# EAGLE schematic IM-EG2-Bottom-Board (EAGLE 7.5.0)
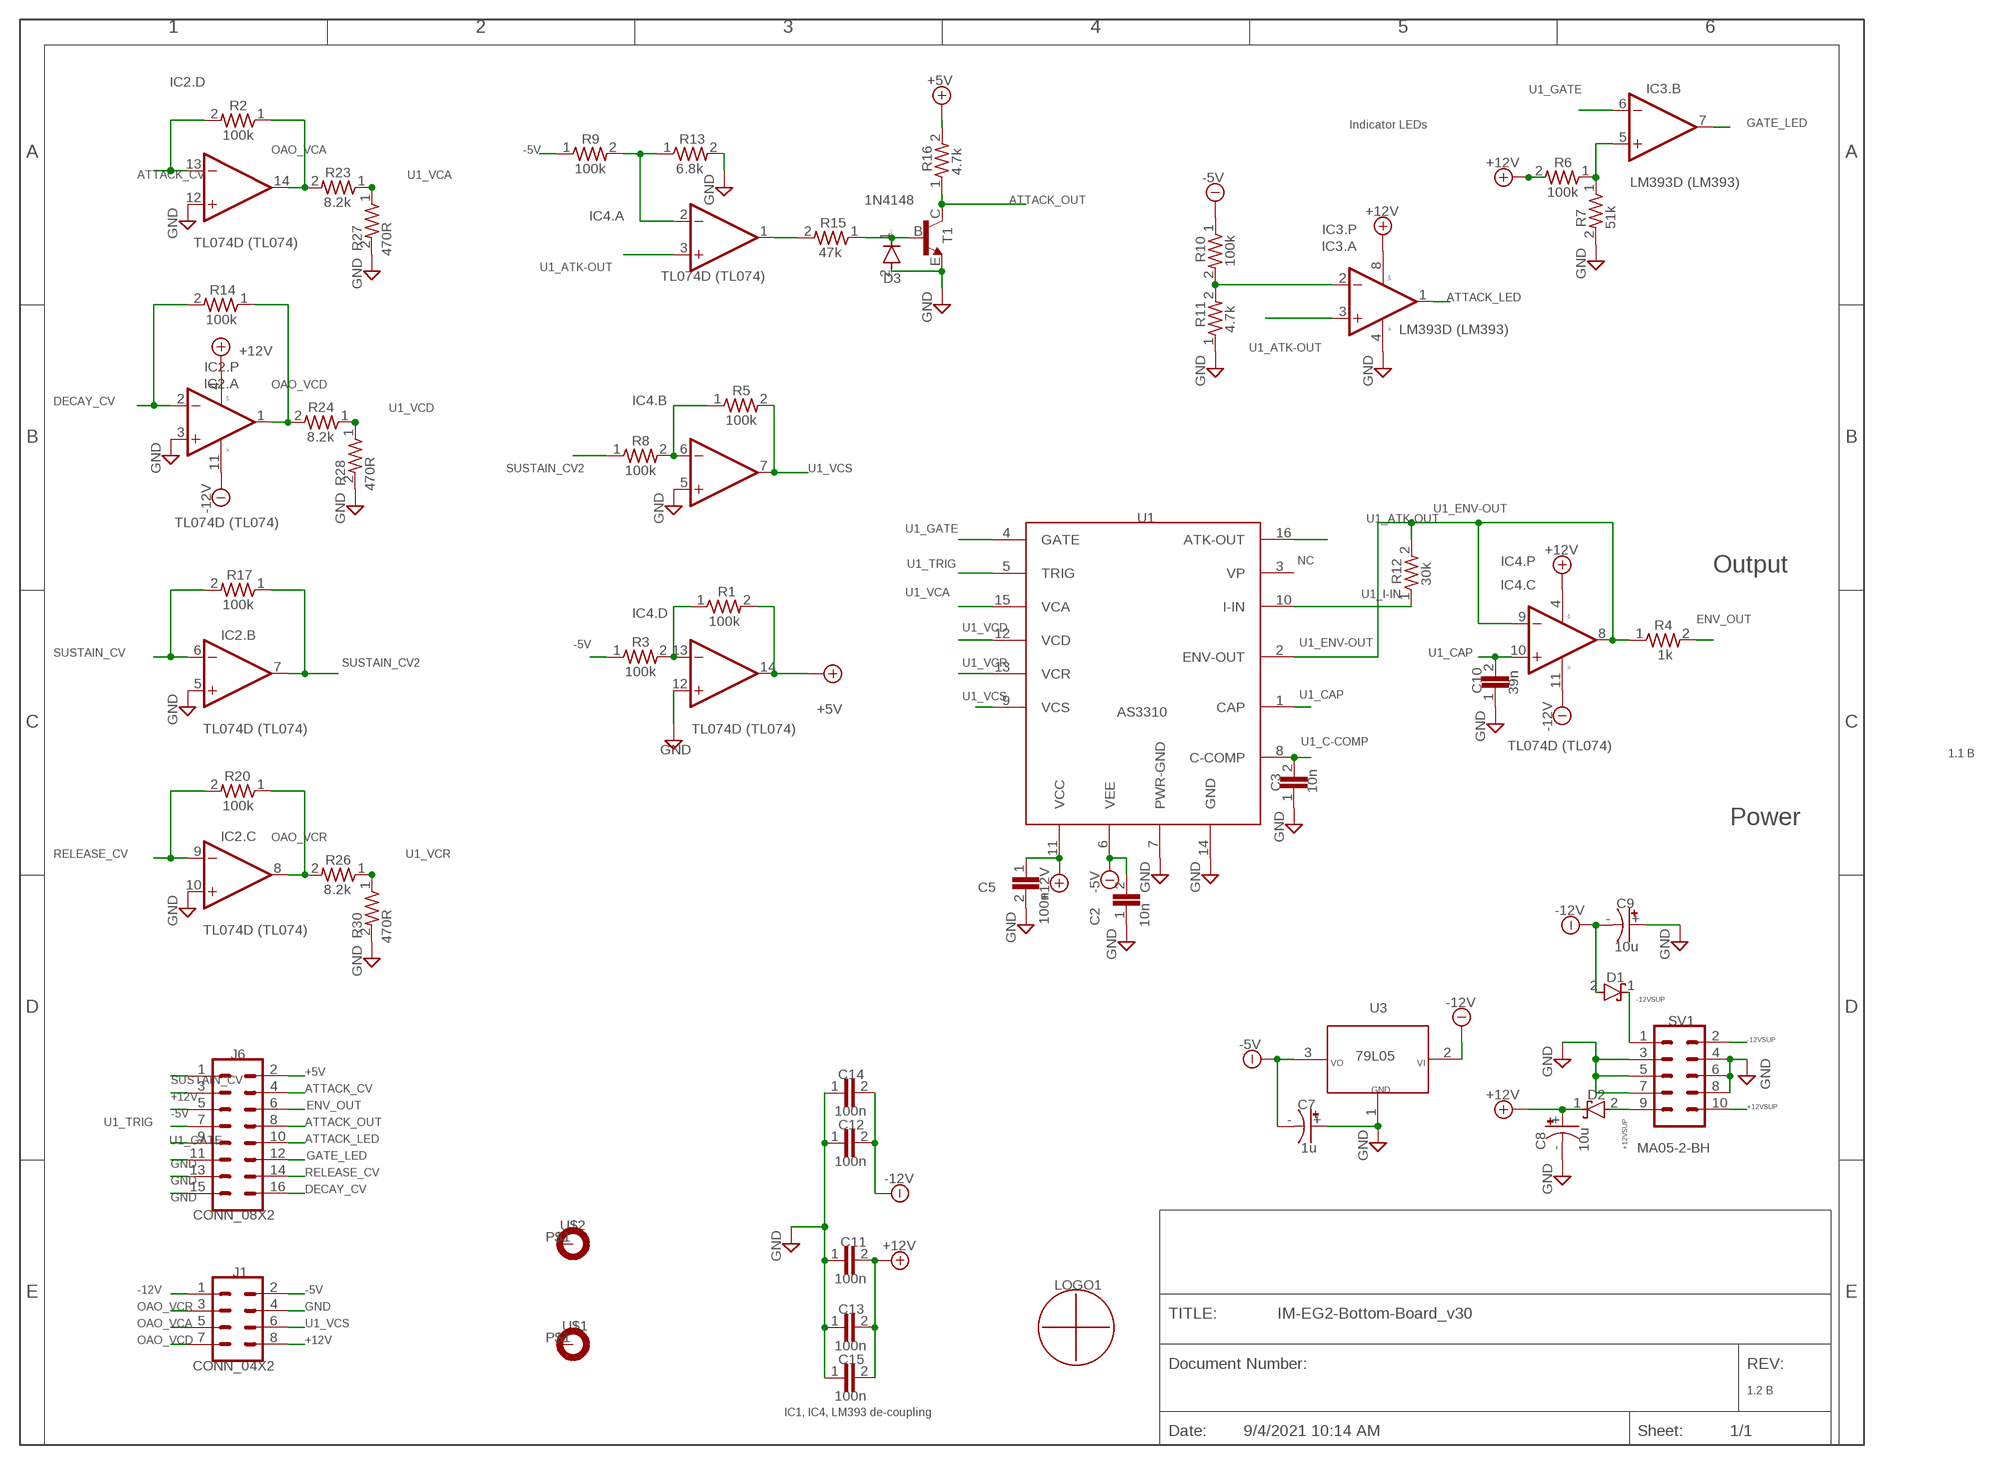
[diagram p0: schematic, sheet 1]

## Parts
C2  10n  C-EUC0805_(C-EU)  [C0805]
C3  10n  C-EUC0805_(C-EU)  [C0805]
C5  100n  C-EUC0805_(C-EU)  [C0805]
C7  1u  CPOL-USE2-5_(CPOL-US)  [E2-5]
C8  10u  CPOL-USE2-5_(CPOL-US)  [E2-5]
C9  10u  CPOL-USE2-5_(CPOL-US)  [E2-5]
C10  39n  C-EUC0805_(C-EU)  [C0805]
C11  100n  C-EUC0805_(C-EU)  [C0805]
C12  100n  C-EUC0805_(C-EU)  [C0805]
C13  100n  C-EUC0805_(C-EU)  [C0805]
C14  100n  C-EUC0805_(C-EU)  [C0805]
C15  100n  C-EUC0805_(C-EU)  [C0805]
D1  STPS1L60ZFSOD-123_(STPS1L60ZF)  [SOD3516X98N]
D2  STPS1L60ZFSOD-123_(STPS1L60ZF)  [SOD3516X98N]
D3  1N4148  1N4148SOD-123_(1N4148)  [SOD3715X135]
IC2  TL074D_(TL074)  [SO14]
IC3  LM393D_(LM393)  [SO08]
IC4  TL074D_(TL074)  [SO14]
J1  CONN_04X2  [2X4]
J6  CONN_08X2  [2X8]
LOGO1  IM-LOGO-4MM-1M  [IM-LOGO-4MM-1M]
R1  100k  R-US_R0805_(R-US_)  [R0805]
R2  100k  R-US_R0805_(R-US_)  [R0805]
R3  100k  R-US_R0805_(R-US_)  [R0805]
R4  1k  R-US_R0805_(R-US_)  [R0805]
R5  100k  R-US_R0805_(R-US_)  [R0805]
R6  100k  R-US_R0805_(R-US_)  [R0805]
R7  51k  R-US_R0805_(R-US_)  [R0805]
R8  100k  R-US_R0805_(R-US_)  [R0805]
R9  100k  R-US_R0805_(R-US_)  [R0805]
R10  100k  R-US_R0805_(R-US_)  [R0805]
R11  4.7k  R-US_R0805_(R-US_)  [R0805]
R12  30k  R-US_R0805_(R-US_)  [R0805]
R13  6.8k  R-US_R0805_(R-US_)  [R0805]
R14  100k  R-US_R0805_(R-US_)  [R0805]
R15  47k  R-US_R0805_(R-US_)  [R0805]
R16  4.7k  R-US_R0805_(R-US_)  [R0805]
R17  100k  R-US_R0805_(R-US_)  [R0805]
R20  100k  R-US_R0805_(R-US_)  [R0805]
R23  8.2k  R-US_R0805_(R-US_)  [R0805]
R24  8.2k  R-US_R0805_(R-US_)  [R0805]
R26  8.2k  R-US_R0805_(R-US_)  [R0805]
R27  470R  R-US_R0805_(R-US_)  [R0805]
R28  470R  R-US_R0805_(R-US_)  [R0805]
R30  470R  R-US_R0805_(R-US_)  [R0805]
SV1  MA05-2-BH  [MA05-2-BH]
T1  -NPN-MMBT2369LT1SOT23-BEC_(-NPN-)  [SOT23-BEC]
U1  AS3310  AS3310-2AS3310-SOIC-16_(AS3310-2)  [SOIC127P620X175-16N]
U3  79L05  MC79L05ACLP  [TO-92]
U$1  MOUNT-HOLE-EURORACK3.4-HOLE_(MOUNT-HOLE-EURORACK)  [MOUNT-HOLE-EURORACK]
U$2  MOUNT-HOLE-EURORACK3.4-HOLE_(MOUNT-HOLE-EURORACK)  [MOUNT-HOLE-EURORACK]

## Nets
+5V: IC4.14(PART_D:OUT) J6.2 R1.2 R16.2 ; supply symbol labelled +5V_7
+12V: C5.1 C8.+ C11.2 C13.2 C15.2 D2.1(C) IC2.4(PART_P:V+) IC3.8(PART_P:V+) IC4.4(PART_P:V+) J1.8 J6.3 R6.2 U1.11(VCC) ; supply symbol labelled +12V_9
+12VSUP: D2.2(A) SV1.9 SV1.10
-5V: C2.2 C7.- J1.2 J6.5 R3.1 R9.1 R10.1 U1.6(VEE) U3.3(VO) ; supply symbol labelled -5V_14
-12V: C9.- C12.2 C14.2 D1.2(A) IC2.11(PART_P:V-) IC4.11(PART_P:V-) J1.1 U3.2(VI) ; supply symbol labelled -12V_17
-12VSUP: D1.1(C) SV1.1 SV1.2
-230MV: IC3.2(PART_A:-IN) R10.2 R11.2
ATTACK_CV: IC2.13(PART_D:-IN) J6.4 R2.2
ATTACK_LED: IC3.1(PART_A:OUT) J6.10
ATTACK_OUT: J6.8 R16.1 T1.C
DECAY_CV: IC2.2(PART_A:-IN) J6.16 R14.2
ENV_OUT: J6.6 R4.2
GATE_LED: IC3.7(PART_B:OUT) J6.12
GND: C2.1 C3.1 C5.2 C7.+ C8.- C9.+ C10.1 C11.1 C12.1 C13.1 C14.1 C15.1 D3.2(A) IC2.3(PART_A:+IN) IC2.5(PART_B:+IN) IC2.10(PART_C:+IN) IC2.12(PART_D:+IN) IC3.4(PART_P:V-) IC4.5(PART_B:+IN) IC4.12(PART_D:+IN) J1.4 J6.11 J6.13 J6.15 R7.2 R11.1 R13.2 R27.2 R28.2 R30.2 SV1.3 SV1.4 SV1.5 SV1.6 SV1.7 SV1.8 T1.E U1.7(PWR-GND) U1.14(GND) U3.1(GND)
N$2: D3.1(C) R15.1 T1.B
N$3: IC4.13(PART_D:-IN) R1.1 R3.2
N$5: IC4.6(PART_B:-IN) R5.1 R8.2
N$6: IC4.1(PART_A:OUT) R15.2
N$7: IC4.2(PART_A:-IN) R9.2 R13.1
N$9: IC3.5(PART_B:+IN) R6.1 R7.1
OAO_VCA: IC2.14(PART_D:OUT) J1.5 R2.1 R23.2
OAO_VCD: IC2.1(PART_A:OUT) J1.7 R14.1 R24.2
OAO_VCR: IC2.8(PART_C:OUT) J1.3 R20.1 R26.2
RELEASE_CV: IC2.9(PART_C:-IN) J6.14 R20.2
SUSTAIN_CV: IC2.6(PART_B:-IN) J6.1 R17.2
SUSTAIN_CV2: IC2.7(PART_B:OUT) R8.1 R17.1
U1_ATK-OUT: IC3.3(PART_A:+IN) IC4.3(PART_A:+IN) U1.16(ATK-OUT)
U1_C-COMP: C3.2 U1.8(C-COMP)
U1_CAP: C10.2 IC4.10(PART_C:+IN) U1.1(CAP)
U1_ENV-OUT: IC4.8(PART_C:OUT) IC4.9(PART_C:-IN) R4.1 R12.2 U1.2(ENV-OUT)
U1_GATE: IC3.6(PART_B:-IN) J6.9 U1.4(GATE)
U1_I-IN: R12.1 U1.10(I-IN)
U1_TRIG: J6.7 U1.5(TRIG)
U1_VCA: R23.1 R27.1 U1.15(VCA)
U1_VCD: R24.1 R28.1 U1.12(VCD)
U1_VCR: R26.1 R30.1 U1.13(VCR)
U1_VCS: IC4.7(PART_B:OUT) J1.6 R5.2 U1.9(VCS)
Unconnected: U1.3(VP) U$1.P$1(MOUNT) U$2.P$1(MOUNT)

## Notes on the sheet
- 1 | 2 | 3 | 4 | 5 | 6
- IC2.D | +5V
- U1_GATE | IC3.B
- R2
- 100k | Indicator LEDs | GATE_LED
- A | R9 | R13 | A
- OAO_VCA | -5V
- 100k | 6.8k | +12V | R6
- ATTACK_CV | R16
- R23 | 4.7k | LM393D (LM393)
- U1_VCA
- -5V
- 100k
- 8.2k | 1N4148
- GND | ATTACK_OUT
- +12V
- IC4.A
- R15 | R7 | 51k
- TL074D (TL074) | IC3.P
- SpiceOrder 2
- GND
- 47k | T1
- R27 | IC3.A
- 470R
- R10
- 100k
- U1_ATK-OUT | TL074D (TL074) | D3 | SpiceOrder 1
- GND
- V+
- GND
- R14
- ATTACK_LED
- 100k
- GND | LM393D (LM393)
- R11
- V-
- 4.7k
- U1_ATK-OUT
- +12V
- IC2.P
- IC2.A | OAO_VCD | GND | GND
- R5
- V+
- DECAY_CV | IC4.B
- R24 | U1_VCD | 100k
- B | 8.2k | B
- R8
- V-
- 100k
- GND | SUSTAIN_CV2 | U1_VCS
- R28
- 470R
- -12V | U1_ENV-OUT
- TL074D (TL074)
- GND | GND | U1 | U1_ATK-OUT
- U1_GATE
- +12V
- NC | IC4.P
- U1_TRIG
- Output
- R17
- R12 | 30k
- IC4.C
- 100k | R1 | U1_VCA | U1_I-IN
- IC4.D | 100k
- V+
- ENV_OUT
- U1_VCD | R4
- IC2.B
- -5V | R3 | U1_ENV-OUT | 1k
- SUSTAIN_CV | U1_CAP
- SUSTAIN_CV2 | 100k | U1_VCR
- V-
- C10 | 39n
- U1_VCS | U1_CAP
- AS3310
- C | +5V | C
- GND | TL074D (TL074) | TL074D (TL074)
- -12V
- GND | TL074D (TL074)
- GND | U1_C-COMP
- 1.1 B
- R20
- C3 | 10n
- 100k
- Power
- IC2.C | OAO_VCR | GND
- RELEASE_CV | U1_VCR
- R26
- 8.2k
- C5 | -5V | GND | GND
- +12V
- C9
- -12V
- GND | TL074D (TL074) | 100n | C2 | 10n
- R30 | 10u
- 470R | GND
- GND | GND
- GND
- D1
- D | D
- U3 | -12VSUP
- -12V
- SV1
- -12VSUP
- -5V | 79L05
- J6
- VO | VI
- SUSTAIN_CV | +5V | GND
- C14
- GND
- +12V | ATTACK_CV | GND
- +12V | D2
- 100n
- -5V | ENV_OUT | C7 | +12VSUP
- U1_TRIG | ATTACK_OUT
- C12
- U1_GATE
- ATTACK_LED | 1u | MA05-2-BH
- C8 | 10u | +12VSUP
- 100n
- GND | GATE_LED | GND
- GND | RELEASE_CV
- -12V
- GND | DECAY_CV | GND
- CONN_08X2
- U$2
- C11 | +12V
- GND
- J1 | 100n
- E | E
- LOGO1
- -12V | -5V
- OAO_VCR | GND
- C13
- TITLE: | IM-EG2-Bottom-Board_v30
- OAO_VCA | U1_VCS
- U$1
- 100n
- OAO_VCD | +12V
- CONN_04X2 | C15
- Document Number: | REV:
- 100n
- 1.2 B
- IC1, IC4, LM393 de-coupling
- Date: | 9/4/2021 10:14 AM | Sheet: | 1/1

## Library data of the parts
C2 C3 = common:C-EUC0805_(C-EU); SPICEPREFIX: C
C5 C10-C15 = common:C-EUC0805_(C-EU); SPICEPREFIX: C; VALUE: 10n
C7 = common:CPOL-USE2-5_(CPOL-US); SPICEPREFIX: C
C8 C9 = common:CPOL-USE2-5_(CPOL-US); SPICEPREFIX: C; VALUE: 1u
D1 D2 = common:STPS1L60ZFSOD-123_(STPS1L60ZF)
D3 = common:1N4148SOD-123_(1N4148)
IC2 IC4 = common:TL074D_(TL074)
IC3 = common:LM393D_(LM393)
J1 = common:CONN_04X2
J6 = common:CONN_08X2
LOGO1 = common:IM-LOGO-4MM-1M
R1-R3 R5 R6 R8-R10 R14 R17 R20 = common:R-US_R0805_(R-US_); SPICEPREFIX: R
R4 R7 R11-R13 R15 R16 R23 R24 R26-R28 R30 = common:R-US_R0805_(R-US_); SPICEPREFIX: R; VALUE: 100k
SV1 = common:MA05-2-BH; OC_FARNELL: unknown; OC_NEWARK: unknown
T1 = common:-NPN-MMBT2369LT1SOT23-BEC_(*-NPN-)
U1 = common:AS3310-2AS3310-SOIC-16_(AS3310-2)
U3 = common:MC79L05ACLP
U$1 U$2 = common:MOUNT-HOLE-EURORACK3.4-HOLE_(MOUNT-HOLE-EURORACK)